# EAGLE design usb (EAGLE 8.4.2)
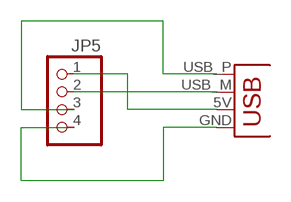
[diagram p0: schematic, sheet 1]

## Parts
JP5  PINHD-1X4M  [1X04M]
X1  USBPCB  [USB-A-PCB]

## Nets
5V: JP5.1 X1.5V(VBUS)
GND: JP5.4 X1.GND
USB_N: JP5.2 X1.USB_M(D-)
USB_P: JP5.3 X1.USB_P(D+)

## Library data of the parts
JP5 = pinhead:PINHD-1X4: PIN HEADER
X1 = usb:USB: USB Connectors USB-B-PTH is fully proven SKU : PRT-00139 USB-miniB is fully proven SKU : PRT-00587 USB-A-PCB is untested. USB-A-H is throughly reviewed, but untested. Spark Fun Electronics SKU : PRT-00437 USB-B-SMT is throughly reviewed, but untested. Needs silkscreen touching up. USB-A-S has not been used/tested USB-MB-H has not been used/tested

## Board
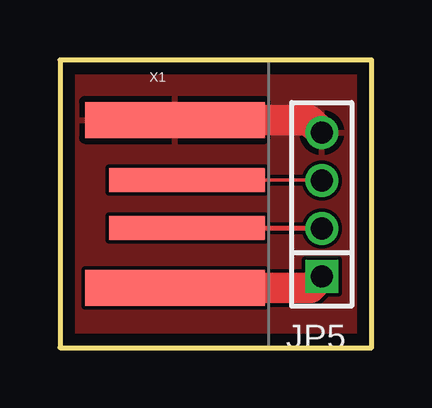
[diagram p1: board, top side]
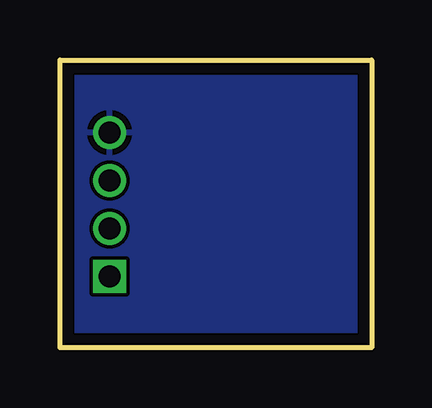
[diagram p2: board, bottom side, seen from below]

Size 13 x 12 mm. Coordinates in mm from the lower left corner, seen from the top.
Outline: 0,0 13,0 13,12 0,12 0,0
Copper layers (1*16): Top 0.035mm / dielectric 1.6mm / Bottom 0.035mm
Design rules "Elecrow_2-layer_PCB_eagle_rule": minimum track width 6mil, minimum drill 12mil, track to track 6mil, track to pad 6mil, pad to pad 6mil, via to via 8mil, smd to smd 0mil, copper to edge 20mil, drill to drill 10mil, minimum pad ring 6mil, minimum via ring 6mil, stop-mask expansion 0mil, vias tented up to drill 100mil, thermal gap 10mil

### Footprints (pad centres in the part's own frame; a part is rotated, then mirrored left to right if it is on the bottom)
1X04M = drill 0.914 square: 1 -3,0 | drill 0.914: 2 -1,0; 3 1,0; 4 3,0
USB-A-PCB = smd 7.5 x 1.5: 5V -0.2,-3.5; GND -0.2,3.5 | smd 6.5 x 1: USB_M 0.3,-1; USB_P 0.3,1

### Placement (x,y rotation side)
JP5  10.92,5.97 90 top
X1  5,6 0 top

### Tracks (layer width: path | path; a pad name or v marks a point on that pad's centre or on a via)
5V
  Top 1.27: X1.5V 10.45,2.5 JP5.1
GND
  Top 1.27: X1.GND 10.39,9.5 JP5.4
  pour Bottom: 0,0 13,0 13,12 0,12
  pour Top: 0,0 13,0 13,12 0,12
USB_N
  Top 0.2: X1.USB_M 10.89,5 JP5.2
USB_P
  Top 0.152: X1.USB_P 10.89,7 JP5.3